# Altium schematic sheet 14_HD4_PUMP.SchDoc
size 420 x 297 mm; SheetNumber: 22; SheetTotal: 29
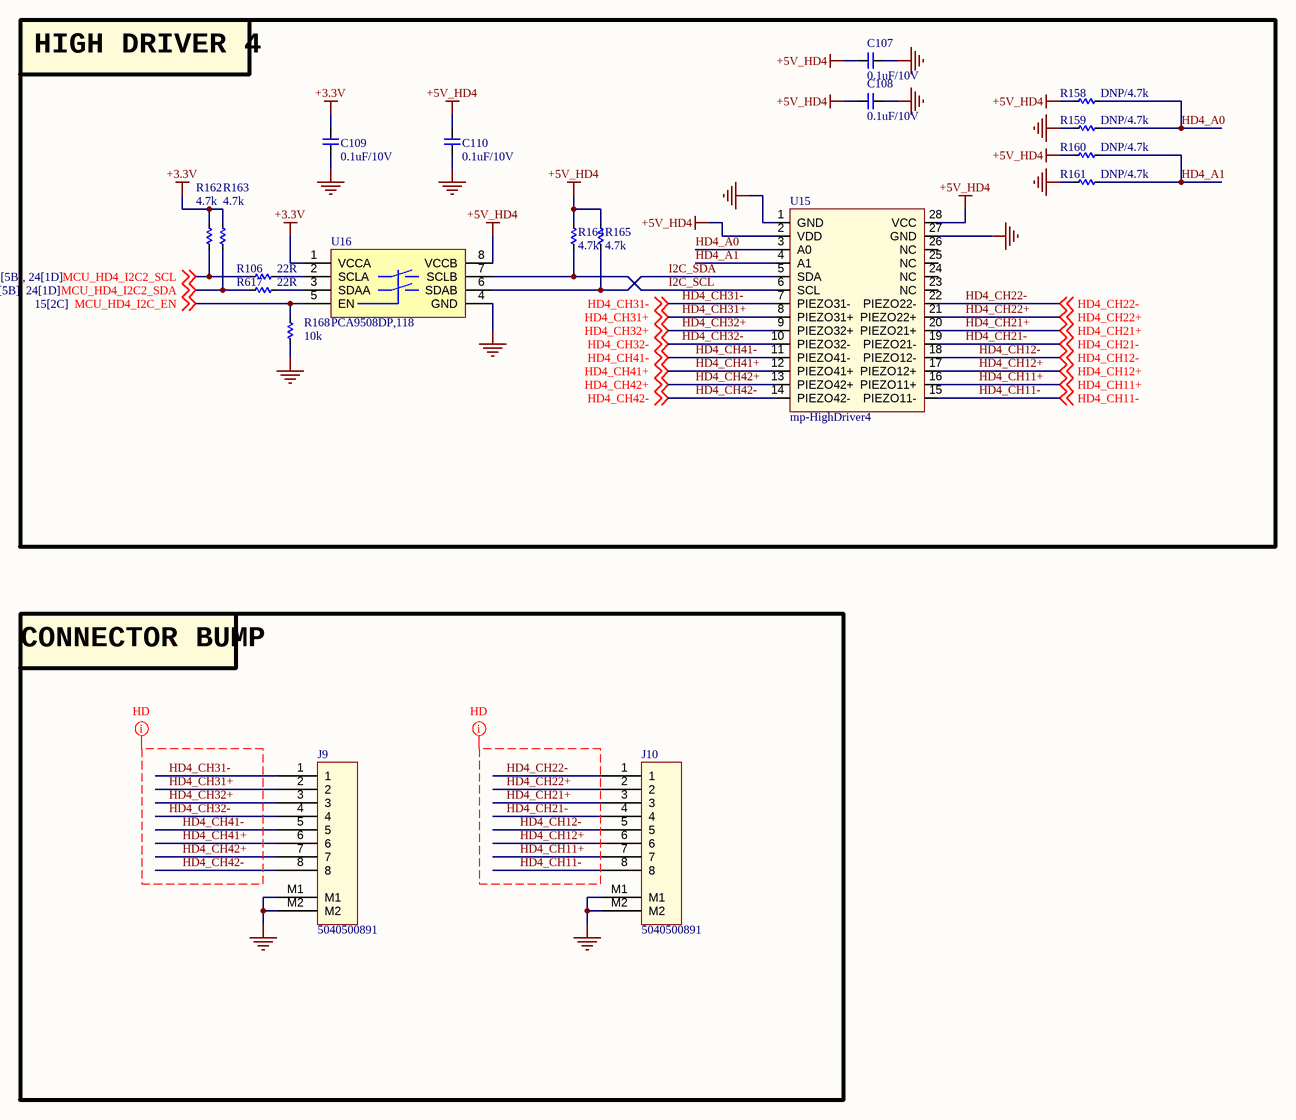
[diagram p0: 14_HD4_PUMP.SchDoc]

## Parts
C107  0.1uF/10V  [CAP_C_1005X60]
C108  0.1uF/10V  [CAP_C_1005X60]
C109  0.1uF/10V  [CAP_C_1005X60]
C110  0.1uF/10V  [CAP_C_1005X60]
J9  5040500891  [MOLEX_5040500891]
J10  5040500891  [MOLEX_5040500891]
R106  22R  [RES_C_1005X40]
R158  DNP/4.7k  [RES_C_1005X40]
R159  DNP/4.7k  [RES_C_1005X40]
R160  DNP/4.7k  [RES_C_1005X40]
R161  DNP/4.7k  [RES_C_1005X40]
R162  4.7k  [RES_C_1005X40]
R163  4.7k  [RES_C_1005X40]
R164  4.7k  [RES_C_1005X40]
R165  4.7k  [RES_C_1005X40]
R168  10k  [RES_C_1005X40]
R617  22R  [RES_C_1005X40]
U15  mp-HighDriver4  [MP_HIGHDRIVER4]
U16  PCA9508DP,118  [TSOP8]

## Blocks framed on the sheet
HIGH DRIVER 4: C107-C110 R106 R158-R165 R168 R617 U15 U16
CONNECTOR BUMP: J9 J10

## Nets
+3.3V: C109.2 R162.1 R163.1 U16.1(VCCA)
+5V_HD4: C107.2 C108.2 C110.2 R158.1 R160.1 R164.1 R165.1 U15.2(VDD) U15.28(VCC) U16.8(VCCB)
GND: C107.1 C108.1 C109.1 C110.1 J9.M1 J9.M2 J10.M1 J10.M2 R159.1 R161.1 R168.2 U15.1(GND) U15.27(GND) U16.4(GND)
HD4_A0: R158.2 R159.2 U15.3(A0)
HD4_A1: R160.2 R161.2 U15.4(A1)
HD4_CH11+: J10.7 U15.16(PIEZO11+) ; off-sheet HD4_CH11+
HD4_CH11-: J10.8 U15.15(PIEZO11-) ; off-sheet HD4_CH11-
HD4_CH12+: J10.6 U15.17(PIEZO12+) ; off-sheet HD4_CH12+
HD4_CH12-: J10.5 U15.18(PIEZO12-) ; off-sheet HD4_CH12-
HD4_CH21+: J10.3 U15.20(PIEZO21+) ; off-sheet HD4_CH21+
HD4_CH21-: J10.4 U15.19(PIEZO21-) ; off-sheet HD4_CH21-
HD4_CH22+: J10.2 U15.21(PIEZO22+) ; off-sheet HD4_CH22+
HD4_CH22-: J10.1 U15.22(PIEZO22-) ; off-sheet HD4_CH22-
HD4_CH31+: J9.2 U15.8(PIEZO31+) ; off-sheet HD4_CH31+
HD4_CH31-: J9.1 U15.7(PIEZO31-) ; off-sheet HD4_CH31-
HD4_CH32+: J9.3 U15.9(PIEZO32+) ; off-sheet HD4_CH32+
HD4_CH32-: J9.4 U15.10(PIEZO32-) ; off-sheet HD4_CH32-
HD4_CH41+: J9.6 U15.12(PIEZO41+) ; off-sheet HD4_CH41+
HD4_CH41-: J9.5 U15.11(PIEZO41-) ; off-sheet HD4_CH41-
HD4_CH42+: J9.7 U15.13(PIEZO42+) ; off-sheet HD4_CH42+
HD4_CH42-: J9.8 U15.14(PIEZO42-) ; off-sheet HD4_CH42-
I2C_SCL: R164.2 U15.6(SCL) U16.7(SCLB)
I2C_SDA: R165.2 U15.5(SDA) U16.6(SDAB)
MCU_HD4_I2C2_SCL: R106.2 R162.2 ; off-sheet MCU_HD4_I2C2_SCL
MCU_HD4_I2C2_SDA: R163.2 R617.2 ; off-sheet MCU_HD4_I2C2_SDA
MCU_HD4_I2C_EN: R168.1 U16.5(EN) ; off-sheet MCU_HD4_I2C_EN
NetR106_1: R106.1 U16.2(SCLA)
NetR617_1: R617.1 U16.3(SDAA)

Not connected (* = marked no-connect by the designer): U15 23(NC) 24(NC) 25(NC) 26(NC)

## Layout directives
net class HD: HD4_CH11+, HD4_CH11-, HD4_CH12+, HD4_CH12-, HD4_CH21+, HD4_CH21-, HD4_CH22+, HD4_CH22-, HD4_CH31+, HD4_CH31-, HD4_CH32+, HD4_CH32-, HD4_CH41+, HD4_CH41-, HD4_CH42+, HD4_CH42-

## Notes on the sheet
- Project:
- Sub-system:
- Design by:
- Sheet title:
- Sheet
- of
- Checked by:
- Approved by:
- Revision:
- Document No:
- Size:
- Date:
- A3

## Library data of the parts
C107-C110 = _CAP_C_2: CAP CHIP
J9 J10 = Header 8x1_2M
R106 R158-R165 R168 R617 = _RES_B_2: RES
U15 = mp_HighDriver4